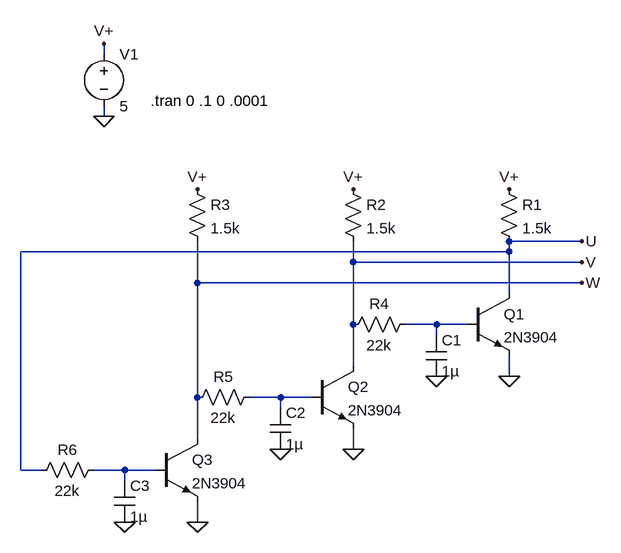
[diagram p0: schematic 06A-09.asc]
06A-09.asc, the LTspice schematic file:
Version 4.1
SHEET 1 880 680
WIRE -304 -256 -304 -272
WIRE -304 -160 -304 -176
WIRE 432 32 320 32
WIRE 320 48 320 32
WIRE 320 48 -432 48
WIRE 80 64 80 32
WIRE 432 64 80 64
WIRE -160 96 -160 32
WIRE 432 96 -160 96
WIRE 320 112 320 48
WIRE 80 160 80 64
WIRE 208 160 160 160
WIRE 256 160 208 160
WIRE 208 176 208 160
WIRE 80 224 80 160
WIRE 320 240 320 208
WIRE -160 272 -160 96
WIRE -32 272 -80 272
WIRE 16 272 -32 272
WIRE -32 288 -32 272
WIRE -160 336 -160 272
WIRE 80 352 80 320
WIRE -432 384 -432 48
WIRE -400 384 -432 384
WIRE -272 384 -320 384
WIRE -224 384 -272 384
WIRE -272 400 -272 384
WIRE -160 464 -160 432
FLAG -272 464 0
FLAG -160 464 0
FLAG -32 352 0
FLAG 80 352 0
FLAG 208 240 0
FLAG 320 240 0
FLAG 320 -48 V+
FLAG 80 -48 V+
FLAG -160 -48 V+
FLAG 432 32 U
FLAG 432 64 V
FLAG 432 96 W
FLAG -304 -160 0
FLAG -304 -272 V+
SYMBOL npn 256 112 R0
SYMATTR InstName Q1
SYMATTR Value 2N3904
SYMBOL res 304 -64 R0
SYMATTR InstName R1
SYMATTR Value 1.5k
SYMBOL res 64 -64 R0
SYMATTR InstName R2
SYMATTR Value 1.5k
SYMBOL res -176 -64 R0
SYMATTR InstName R3
SYMATTR Value 1.5k
SYMBOL res 176 144 R90
WINDOW 0 0 56 VBottom 2
WINDOW 3 32 56 VTop 2
SYMATTR InstName R4
SYMATTR Value 22k
SYMBOL res -64 256 R90
WINDOW 0 0 56 VBottom 2
WINDOW 3 32 56 VTop 2
SYMATTR InstName R5
SYMATTR Value 22k
SYMBOL res -304 368 R90
WINDOW 0 0 56 VBottom 2
WINDOW 3 32 56 VTop 2
SYMATTR InstName R6
SYMATTR Value 22k
SYMBOL npn 16 224 R0
SYMATTR InstName Q2
SYMATTR Value 2N3904
SYMBOL npn -224 336 R0
SYMATTR InstName Q3
SYMATTR Value 2N3904
SYMBOL cap 192 176 R0
SYMATTR InstName C1
SYMATTR Value 1µ
SYMBOL cap -48 288 R0
SYMATTR InstName C2
SYMATTR Value 1µ
SYMBOL cap -288 400 R0
SYMATTR InstName C3
SYMATTR Value 1µ
SYMBOL voltage -304 -272 R0
WINDOW 123 0 0 Left 0
WINDOW 39 0 0 Left 0
SYMATTR InstName V1
SYMATTR Value 5
TEXT -232 -184 Left 2 !.tran 0 .1 0 .0001

The netlist it stands for:
* 06A-09.asc
Q1 U N001 0 0 2N3904
R1 V+ U 1.5k
R2 V+ V 1.5k
R3 V+ W 1.5k
R4 N001 V 22k
R5 N002 W 22k
R6 N003 U 22k
Q2 V N002 0 0 2N3904
Q3 W N003 0 0 2N3904
C1 N001 0 1µ
C2 N002 0 1µ
C3 N003 0 1µ
V1 V+ 0 5
.model NPN NPN
.model PNP PNP
.lib standard.bjt
.tran 0 .1 0 .0001
.backanno
.end